# Altium schematic sheet AQM_Schematic.SchDoc
size A4
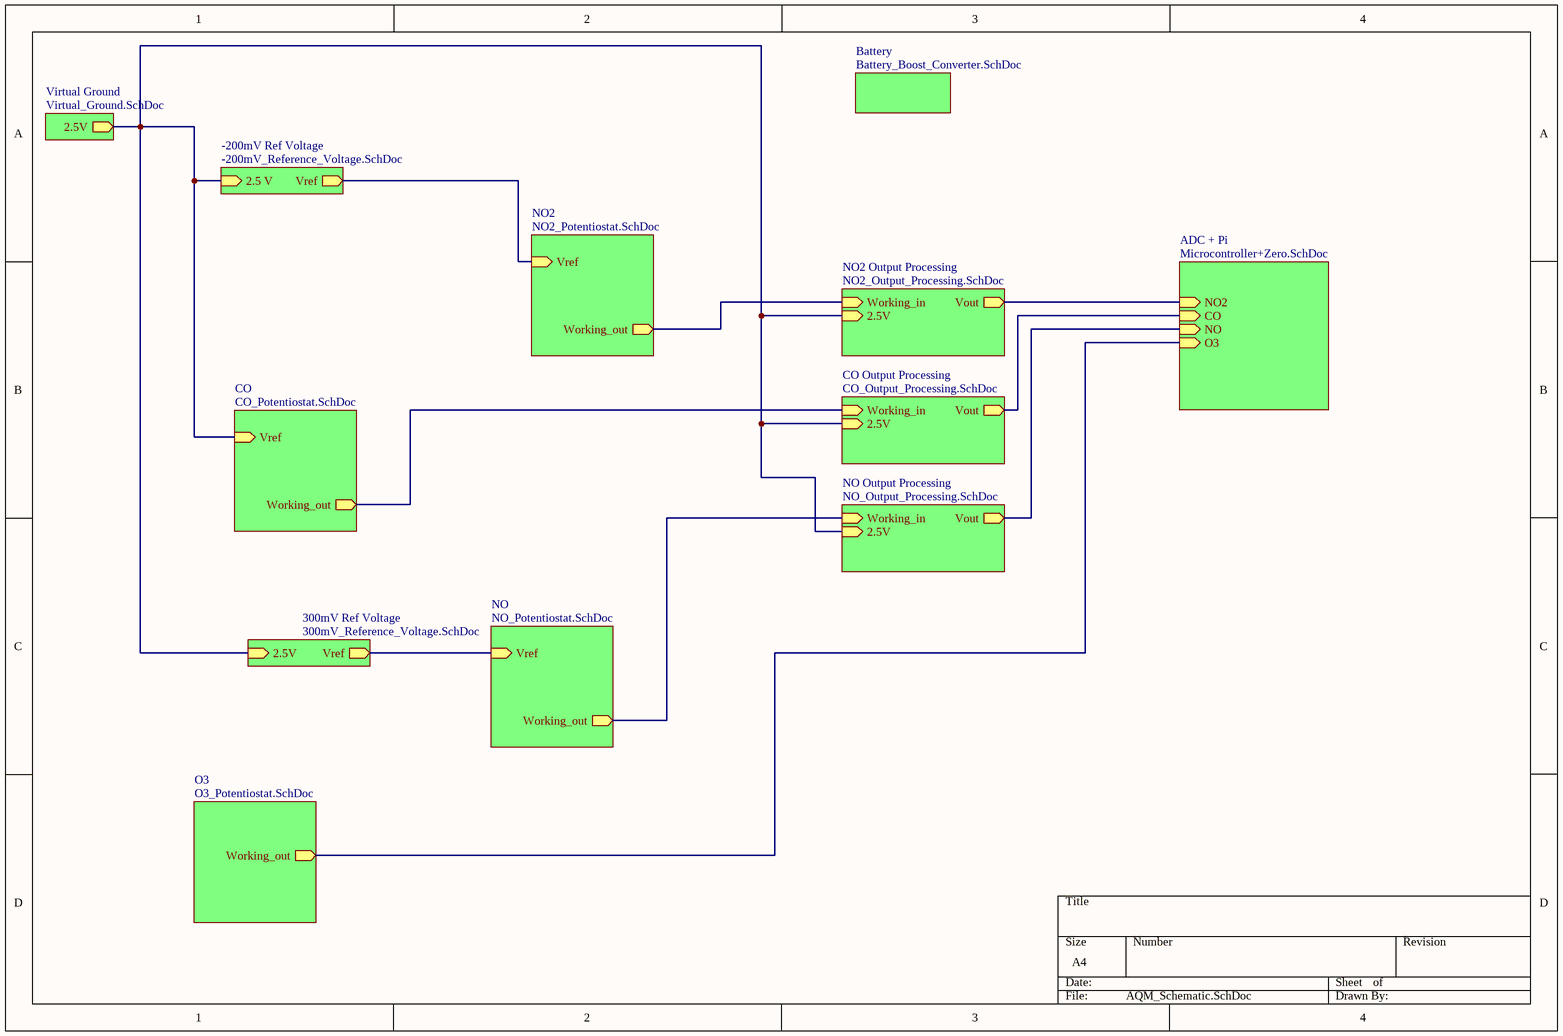
[diagram p0: AQM_Schematic.SchDoc]

## Sub-sheets
300mV Ref Voltage = 300mV_Reference_Voltage.SchDoc: Vref (out), 2.5V (in)
-200mV Ref Voltage = -200mV_Reference_Voltage.SchDoc: Vref (out), 2.5 V (in)
ADC + Pi = Microcontroller+Zero.SchDoc: CO (in), NO (in), NO2 (in), O3 (in)
Battery = Battery_Boost_Converter.SchDoc: no entries
CO = CO_Potentiostat.SchDoc: Vref (in), Working_out (out)
CO Output Processing = CO_Output_Processing.SchDoc: Working_in (in), Vout (out), 2.5V (in)
NO = NO_Potentiostat.SchDoc: Vref (in), Working_out (out)
NO2 = NO2_Potentiostat.SchDoc: Vref (in), Working_out (out)
NO2 Output Processing = NO2_Output_Processing.SchDoc: Working_in (in), Vout (out), 2.5V (in)
NO Output Processing = NO_Output_Processing.SchDoc: Working_in (in), Vout (out), 2.5V (in)
O3 = O3_Potentiostat.SchDoc: Working_out (out)
Virtual Ground = Virtual_Ground.SchDoc: 2.5V (out)

## Nets
(unnamed): sheet -200mV Ref Voltage/Vref, sheet NO2/Vref
(unnamed): sheet -200mV Ref Voltage/2.5 V, sheet NO2 Output Processing/2.5V, sheet 300mV Ref Voltage/2.5V, sheet CO Output Processing/2.5V, sheet NO Output Processing/2.5V, sheet Virtual Ground/2.5V, sheet CO/Vref
(unnamed): sheet NO2 Output Processing/Working_in, sheet NO2/Working_out
(unnamed): sheet NO2 Output Processing/Vout, sheet ADC + Pi/NO2
(unnamed): sheet 300mV Ref Voltage/Vref, sheet NO/Vref
(unnamed): sheet CO Output Processing/Working_in, sheet CO/Working_out
(unnamed): sheet CO Output Processing/Vout, sheet ADC + Pi/CO
(unnamed): sheet NO Output Processing/Working_in, sheet NO/Working_out
(unnamed): sheet NO Output Processing/Vout, sheet ADC + Pi/NO
(unnamed): sheet O3/Working_out, sheet ADC + Pi/O3